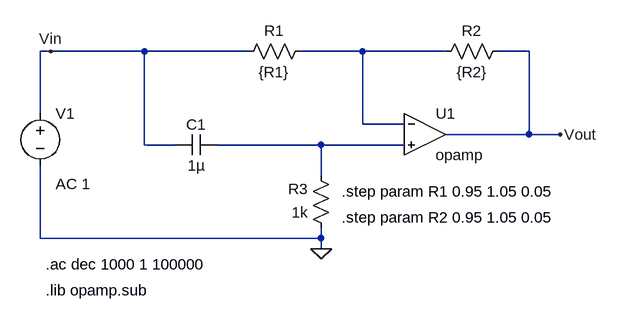
[diagram p0: schematic stepbystep.asc]
stepbystep.asc, the LTspice schematic file:
Version 4
SHEET 1 880 680
WIRE -224 80 -240 80
WIRE -80 80 -224 80
WIRE 80 80 -80 80
WIRE 256 80 160 80
WIRE 384 80 256 80
WIRE 512 80 464 80
WIRE -240 176 -240 80
WIRE 256 192 256 80
WIRE 320 192 256 192
WIRE 512 208 512 80
WIRE 512 208 384 208
WIRE 560 208 512 208
WIRE -80 224 -80 80
WIRE -32 224 -80 224
WIRE 192 224 32 224
WIRE 320 224 192 224
WIRE 192 272 192 224
WIRE -240 368 -240 256
WIRE 192 368 192 352
WIRE 192 368 -240 368
WIRE 192 384 192 368
FLAG 192 384 0
FLAG 560 208 Vout
FLAG -224 80 Vin
SYMBOL res 176 64 R90
WINDOW 0 0 56 VBottom 2
WINDOW 3 32 56 VTop 2
SYMATTR InstName R1
SYMATTR Value {R1}
SYMBOL res 480 64 R90
WINDOW 0 0 56 VBottom 2
WINDOW 3 32 56 VTop 2
SYMATTR InstName R2
SYMATTR Value {R2}
SYMBOL res 208 368 R180
WINDOW 0 36 76 Left 2
WINDOW 3 36 40 Left 2
SYMATTR InstName R3
SYMATTR Value 1k
SYMBOL cap 32 208 R90
WINDOW 0 0 32 VBottom 2
WINDOW 3 32 32 VTop 2
SYMATTR InstName C1
SYMATTR Value 1µ
SYMBOL voltage -240 160 R0
WINDOW 123 24 124 Left 2
WINDOW 39 0 0 Left 0
SYMATTR Value2 AC 1
SYMATTR InstName V1
SYMATTR Value ""
SYMBOL OpAmps\\opamp 352 144 R0
SYMATTR InstName U1
TEXT -232 408 Left 2 !.ac dec 1000 1 100000
TEXT -232 448 Left 2 !.lib opamp.sub
TEXT 224 296 Left 2 !.step param R1 0.95 1.05 0.05
TEXT 224 336 Left 2 !.step param R2 0.95 1.05 0.05

The netlist it stands for:
* stepbystep.asc
R1 N001 Vin {R1}
R2 Vout N001 {R2}
R3 0 N002 1k
C1 N002 Vin 1µ
V1 Vin 0 AC 1
XU1 N001 N002 Vout opamp Aol=100K GBW=10Meg  ; pins invin noninvin out
.ac dec 1000 1 100000
.lib opamp.sub
.step param R1 0.95 1.05 0.05
.step param R2 0.95 1.05 0.05
.backanno
.end